# EAGLE design Adapter_v1.1B (EAGLE 7.2.0)
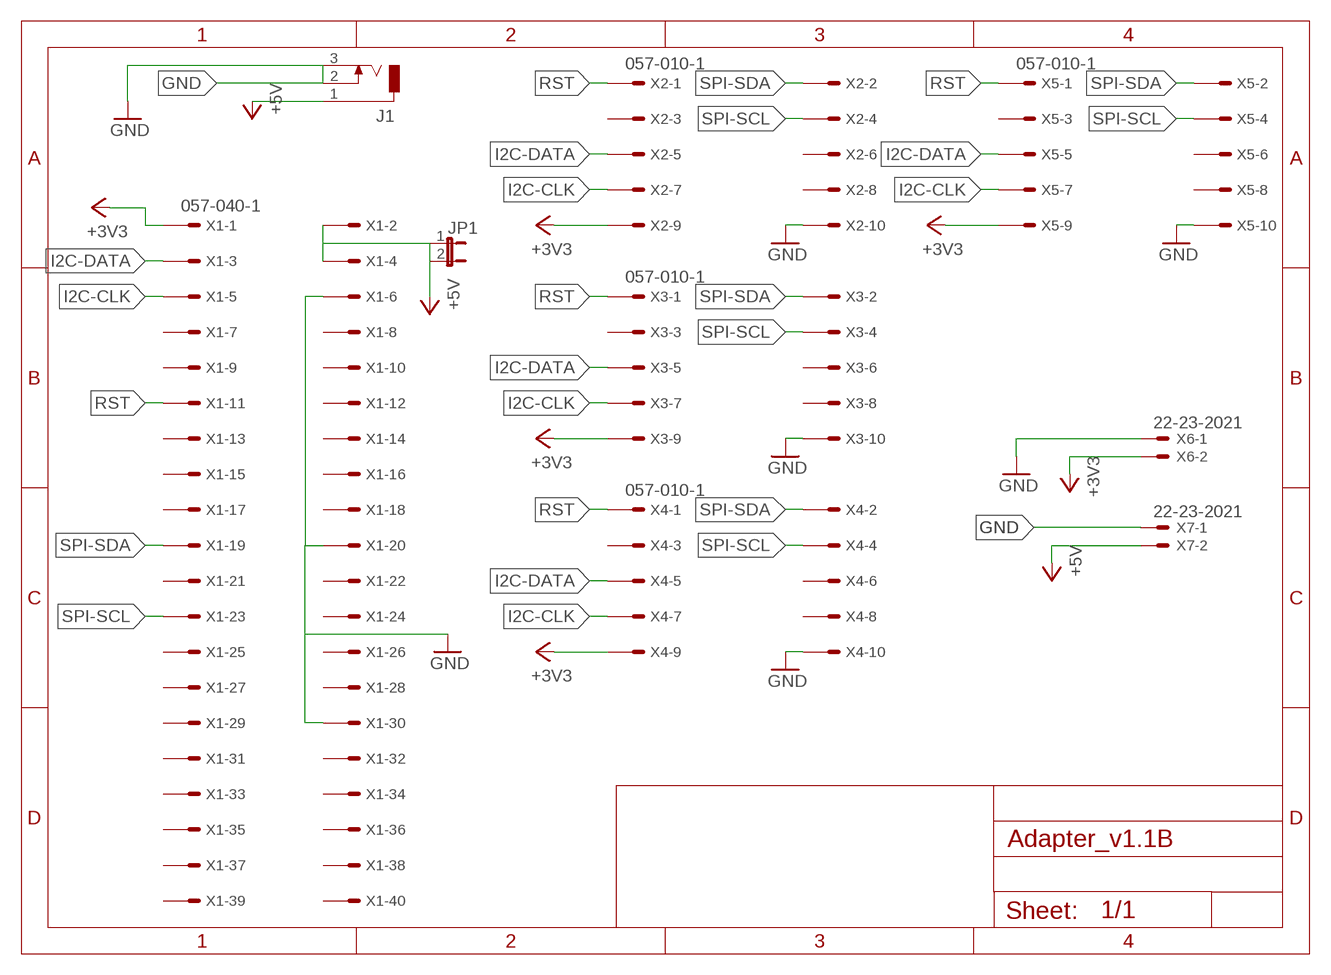
[diagram p0: schematic, sheet 1]

## Parts
J1  DCJ0303  [DCJ0303]
JP1  JP1E  [JP1]
X1  057-040-1  [057-040-1]
X2  057-010-1  [057-010-1]
X3  057-010-1  [057-010-1]
X4  057-010-1  [057-010-1]
X5  057-010-1  [057-010-1]
X6  22-23-2021  [22-23-2021]
X7  22-23-2021  [22-23-2021]

## Nets
+3V3: X1.1 X2.9 X3.9 X4.9 X5.9 X6.2
+5V: J1.1 JP1.1 JP1.2 X1.2 X1.4 X7.2
GND: J1.2 J1.3 X1.6 X1.20 X1.30 X2.10 X3.10 X4.10 X5.10 X6.1 X7.1
I2C-CLK: X1.5 X2.7 X3.7 X4.7 X5.7
I2C-DATA: X1.3 X2.5 X3.5 X4.5 X5.5
RST: X1.11 X2.1 X3.1 X4.1 X5.1
SPI-SCL: X1.23 X2.4 X3.4 X4.4 X5.4
SPI-SDA: X1.19 X2.2 X3.2 X4.2 X5.2
Unconnected: X1.7 X1.8 X1.9 X1.10 X1.12 X1.13 X1.14 X1.15 X1.16 X1.17 X1.18 X1.21 X1.22 X1.24 X1.25 X1.26 X1.27 X1.28 X1.29 X1.31 X1.32 X1.33 X1.34 X1.35 X1.36 X1.37 X1.38 X1.39 X1.40 X2.3 X2.6 X2.8 X3.3 X3.6 X3.8 X4.3 X4.6 X4.8 X5.3 X5.6 X5.8

## Library data of the parts
J1 = con-jack:DCJ0303: DC POWER JACK Source: DCJ0303.pdf; OC_FARNELL: unknown; OC_NEWARK: unknown
JP1 = jumper:JP1E: JUMPER
X1 = con-panduit:057-040-: CONNECTOR 40-pin series 057 contact pc board low profile headers; OC_FARNELL: unknown; OC_NEWARK: unknown
X2-X5 = con-panduit:057-010-: CONNECTOR 10-pin series 057 contact pc board low profile headers; OC_FARNELL: unknown; OC_NEWARK: unknown
X6 X7 = con-molex:22-23-2021: .100" (2.54mm) Center Header - 2 Pin; MF: MOLEX; MPN: 22-23-2021; OC_FARNELL: 1462926; OC_NEWARK: 25C3832

## Board
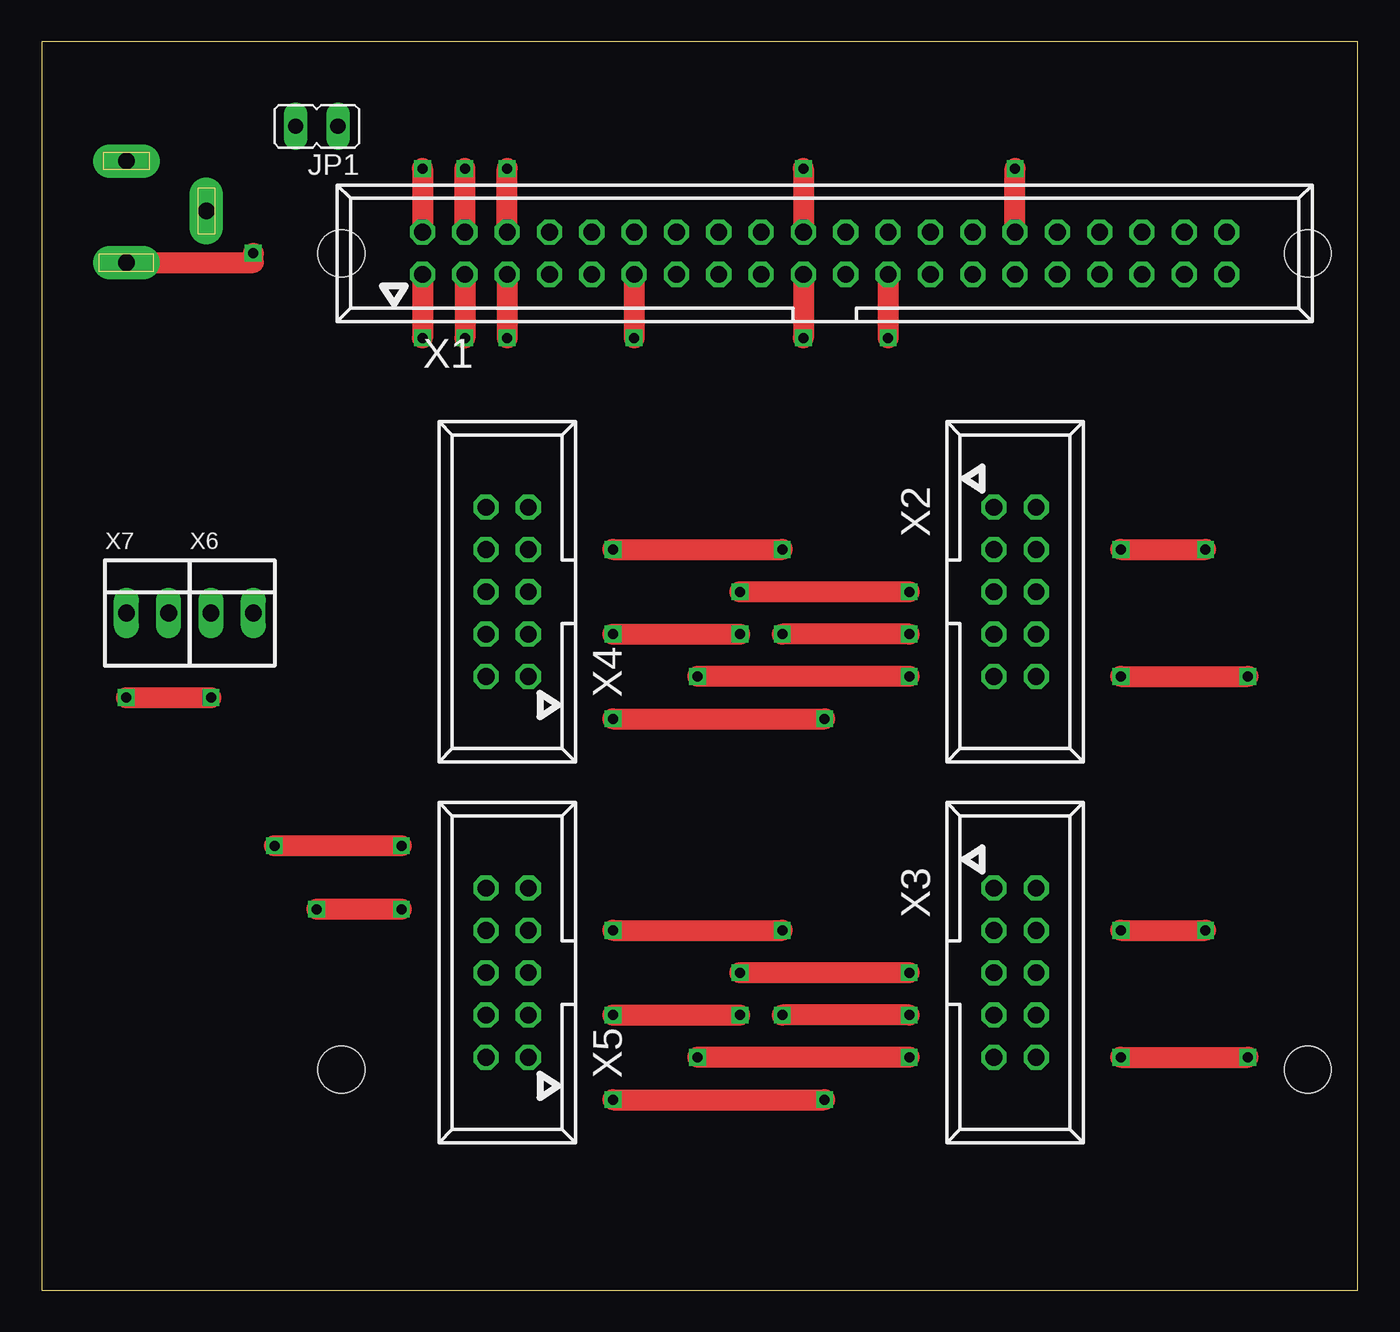
[diagram p1: board, top side]
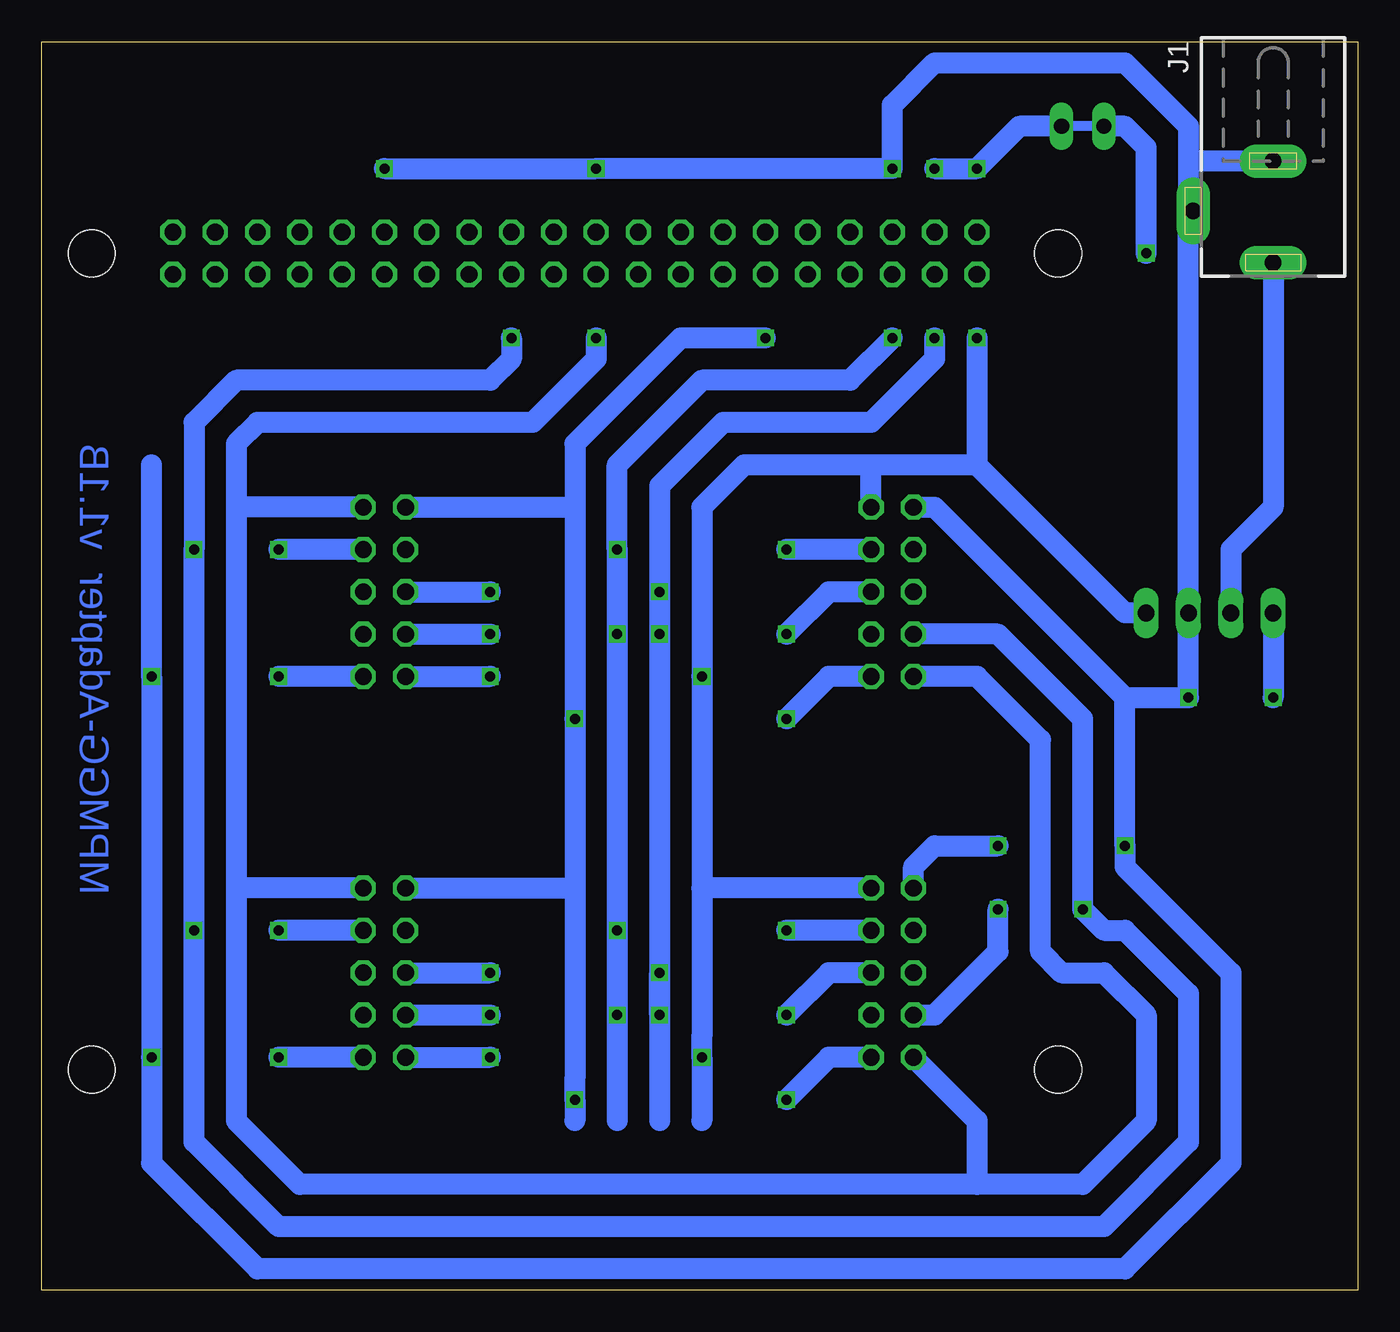
[diagram p2: board, bottom side, seen from below]

Size 78.99 x 74.93 mm. Coordinates in mm from the lower left corner, seen from the top.
Outline: 0,0 78.99,0 78.99,74.93 0,74.93 0,0
Copper layers (1*16): Top 0.035mm / dielectric 1.5mm / Bottom 0.035mm
Design rules "default": minimum track width 10mil, minimum drill 24mil, track to track 8mil, track to pad 8mil, pad to pad 8mil, via to via 8mil, smd to smd 8mil, copper to edge 40mil, drill to drill 8mil, minimum pad ring 10mil, minimum via ring 8mil, stop-mask expansion 4mil, vias tented up to drill 0mil, thermal gap 10mil
Holes 2.8 mm at 17.99,62.23 75.99,62.23 17.99,13.23 75.99,13.23

### Footprints (pad centres in the part's own frame; a part is rotated, then mirrored left to right if it is on the bottom)
DCJ0303 = drill 1 pad 2 long: 1 0,3.1; 2 4.8,0; 3 0,-3
JP1 = drill 0.914 long: 1 0,-1.27; 2 0,1.27
057-040-1 = drill 1 octagon: 1 -24.13,-1.27; 2 -24.13,1.27; 3 -21.59,-1.27; 4 -21.59,1.27; 5 -19.05,-1.27; 6 -19.05,1.27; 7 -16.51,-1.27; 8 -16.51,1.27; 9 -13.97,-1.27; 10 -13.97,1.27; 11 -11.43,-1.27; 12 -11.43,1.27; 13 -8.89,-1.27; 14 -8.89,1.27; 15 -6.35,-1.27; 16 -6.35,1.27; 17 -3.81,-1.27; 18 -3.81,1.27; 19 -1.27,-1.27; 20 -1.27,1.27; 21 1.27,-1.27; 22 1.27,1.27; 23 3.81,-1.27; 24 3.81,1.27; 25 6.35,-1.27; 26 6.35,1.27; 27 8.89,-1.27; 28 8.89,1.27; 29 11.43,-1.27; 30 11.43,1.27; 31 13.97,-1.27; 32 13.97,1.27; 33 16.51,-1.27; 34 16.51,1.27; 35 19.05,-1.27; 36 19.05,1.27; 37 21.59,-1.27; 38 21.59,1.27; 39 24.13,-1.27; 40 24.13,1.27
057-010-1 = drill 1 octagon: 1 -5.08,-1.27; 2 -5.08,1.27; 3 -2.54,-1.27; 4 -2.54,1.27; 5 0,-1.27; 6 0,1.27; 7 2.54,-1.27; 8 2.54,1.27; 9 5.08,-1.27; 10 5.08,1.27
22-23-2021 = drill 1 long: 1 -1.27,0; 2 1.27,0

### Placement (x,y rotation side)
J1  5.08,64.77 180 bottom
JP1  16.51,69.85 90 top
X1  46.99,62.23 0 top
X2  58.42,41.91 270 top
X3  58.42,19.05 270 top
X4  27.94,41.91 90 top
X5  27.94,19.05 90 top
X6  11.43,40.64 0 top
X7  6.35,40.64 0 top

### Tracks (layer width: path | path; a pad name or v marks a point on that pad's centre or on a via)
+3V3  (via drill 0.6)
  Top 1.27: X1.1 v22.86,57.15 | v52.07,36.83 v39.37,36.83 | v52.07,13.97 v39.37,13.97
  Bottom 1.27: X6.2 13.97,40.64 22.86,49.53 | 22.86,49.53 29.21,49.53 | 29.21,49.53 36.83,49.53 39.37,46.99 v39.37,36.83 39.37,24.13 | 39.37,24.13 39.37,15.24 v39.37,13.97 39.37,10.16 | v22.86,57.15 22.86,49.53 | X4.9 29.21,49.53 | X5.9 39.37,24.13 | X2.9 v52.07,36.83 | X3.9 v52.07,13.97
+5V  (via drill 0.6)
  Top 1.27: J1.1 12.7,61.67 v12.7,62.23 | X1.4 v25.4,67.31 | v22.86,67.31 X1.2
  Bottom 0.61: JP1.2 JP1.1
  Bottom 1.27: v12.7,62.23 12.7,68.58 13.97,69.85 JP1.2 | J1.1 5.08,46.99 7.62,44.45 X7.2 | v25.4,67.31 v22.86,67.31 20.32,69.85 JP1.1
GND  (via drill 0.6)
  Top 1.27: v64.77,36.83 v72.39,36.83 | v64.77,13.97 v72.39,13.97 | v21.59,26.67 v13.97,26.67 | v5.08,35.56 v10.16,35.56 | X1.30 v58.42,67.31 | v45.72,67.31 X1.20 | X1.6 v27.94,67.31
  Bottom 1.27: X2.10 v64.77,36.83 | 72.39,49.53 v72.39,36.83 v72.39,13.97 72.39,7.62 66.04,1.27 13.97,1.27 7.62,7.62 7.62,19.05 13.97,25.4 v13.97,26.67 13.97,35.56 | X3.10 v64.77,13.97 | X5.10 26.67,25.4 25.4,26.67 v21.59,26.67 | X7.1 v5.08,35.56 | v58.42,67.31 v45.72,67.31 v27.94,67.31 27.94,71.12 25.4,73.66 13.97,73.66 10.16,69.85 10.16,67.77 | X4.10 25.4,46.99 13.97,35.56 | 13.97,35.56 v10.16,35.56 X6.1 10.16,64.49 J1.2 10.16,65.05 10.16,67.31 10.16,67.77 | J1.3 10.16,67.77
I2C-CLK  (via drill 0.6)
  Top 1.27: X1.5 v27.94,57.15 | v52.07,16.51 v44.45,16.51 | v52.07,39.37 v44.45,39.37 | v34.29,44.45 v44.45,44.45 | v34.29,21.59 v44.45,21.59
  Bottom 1.27: v27.94,57.15 30.48,54.61 39.37,54.61 44.45,49.53 v44.45,44.45 v44.45,39.37 v44.45,21.59 v44.45,16.51 44.45,10.16 | X3.7 v52.07,16.51 | X2.7 v52.07,39.37 | X4.7 v34.29,44.45 | X5.7 v34.29,21.59
I2C-DATA  (via drill 0.6)
  Top 1.27: X1.3 v25.4,57.15 | v52.07,19.05 v41.91,19.05 | v52.07,41.91 v41.91,41.91 | v34.29,39.37 v41.91,39.37 | v34.29,16.51 v41.91,16.51
  Bottom 1.27: v25.4,57.15 25.4,55.88 29.21,52.07 38.1,52.07 41.91,48.26 v41.91,41.91 v41.91,39.37 41.91,21.59 v41.91,19.05 | v41.91,19.05 v41.91,16.51 | v41.91,16.51 41.91,10.16 | X3.5 v52.07,19.05 | X2.5 v52.07,41.91 | X4.5 31.75,41.91 v34.29,39.37 | X5.5 31.75,19.05 v34.29,16.51 | v41.91,16.51 v41.91,19.05
RST  (via drill 0.6)
  Top 1.27: X1.11 v35.56,57.15 | v34.29,34.29 v46.99,34.29 | v34.29,11.43 v46.99,11.43
  Bottom 1.27: v35.56,57.15 40.64,57.15 46.99,50.8 46.99,46.99 | 46.99,46.99 v46.99,34.29 46.99,24.13 | 46.99,24.13 46.99,12.7 v46.99,11.43 46.99,10.16 | X3.1 46.99,24.13 | X2.1 46.99,46.99 | X4.1 31.75,36.83 v34.29,34.29 | X5.1 31.75,13.97 v34.29,11.43
SPI-SCL  (via drill 0.6)
  Top 1.27: X1.23 v50.8,57.15 | v64.77,44.45 v69.85,44.45 | v64.77,21.59 v69.85,21.59 | v21.59,22.86 v16.51,22.86
  Bottom 1.27: v50.8,57.15 50.8,55.88 52.07,54.61 67.31,54.61 69.85,52.07 v69.85,44.45 v69.85,21.59 69.85,8.89 64.77,3.81 15.24,3.81 10.16,8.89 10.16,17.78 13.97,21.59 15.24,21.59 v16.51,22.86 16.51,34.29 21.59,39.37 X4.4 | X2.4 v64.77,44.45 | X3.4 v64.77,21.59 | X5.4 25.4,16.51 21.59,20.32 v21.59,22.86
SPI-SDA  (via drill 0.6)
  Top 1.27: X1.19 v45.72,57.15
  Bottom 1.27: v45.72,57.15 45.72,55.88 49.53,52.07 66.04,52.07 67.31,50.8 67.31,46.99 | 67.31,46.99 67.31,24.13 | 67.31,24.13 67.31,10.16 63.5,6.35 22.86,6.35 | X2.2 67.31,46.99 | X3.2 67.31,24.13 | X5.2 22.86,10.16 22.86,6.35 | 22.86,6.35 16.51,6.35 12.7,10.16 12.7,16.51 15.24,19.05 17.78,19.05 19.05,20.32 19.05,33.02 22.86,36.83 X4.2

### Text on the board
Bottom: MPMGG-Adapter v1.1B